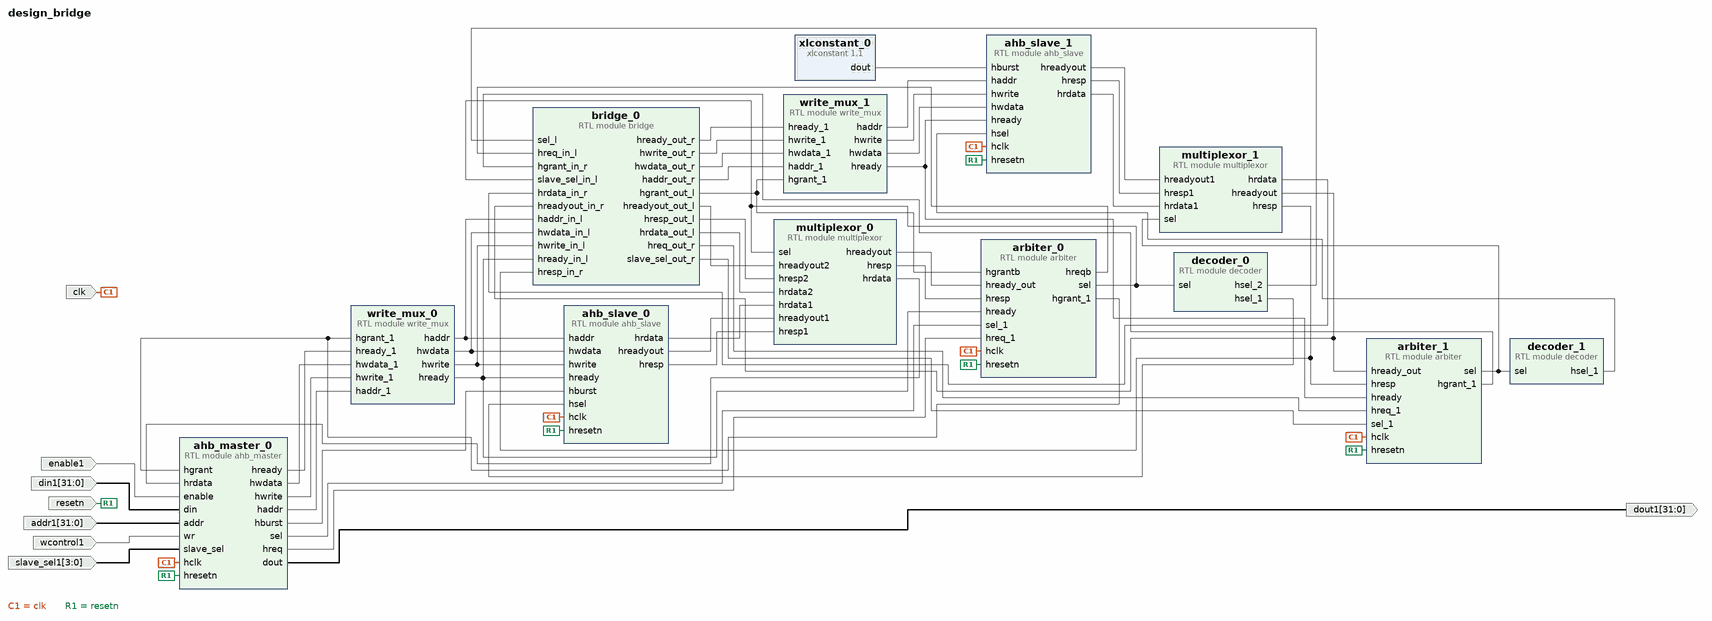
[diagram p0: block diagram of the top level]
# Vivado block design design_bridge, xc7z020clg484-1, Vivado 2019.1
create_bd_design design_bridge

create_bd_port -dir I enable1
create_bd_port -dir I -from 31 -to 0 -type data din1
create_bd_port -dir I -from 31 -to 0 addr1
create_bd_port -dir I wcontrol1
create_bd_port -dir I -from 3 -to 0 slave_sel1
create_bd_port -dir O -from 31 -to 0 -type data dout1
create_bd_port -dir I -type clk clk
set_property -dict {CONFIG.FREQ_HZ 20000000} [get_bd_ports clk]
create_bd_port -dir I -type rst resetn

create_bd_cell -type module -reference decoder decoder_0
create_bd_cell -type module -reference decoder decoder_1
create_bd_cell -type ip -vlnv xilinx.com:ip:xlconstant:1.1 xlconstant_0
set_property -dict {CONFIG.CONST_VAL 0 CONFIG.CONST_WIDTH 3} [get_bd_cells xlconstant_0]
create_bd_cell -type module -reference write_mux write_mux_0
create_bd_cell -type module -reference write_mux write_mux_1
create_bd_cell -type module -reference bridge bridge_0
create_bd_cell -type module -reference arbiter arbiter_0
create_bd_cell -type module -reference arbiter arbiter_1
create_bd_cell -type module -reference multiplexor multiplexor_0
create_bd_cell -type module -reference ahb_slave ahb_slave_0
create_bd_cell -type module -reference ahb_slave ahb_slave_1
create_bd_cell -type module -reference multiplexor multiplexor_1
create_bd_cell -type module -reference ahb_master ahb_master_0

# ---- connections ----

connect_bd_net [get_bd_pins ahb_master_0/sel] [get_bd_pins arbiter_0/sel_1]
connect_bd_net [get_bd_pins arbiter_0/sel] [get_bd_pins decoder_0/sel] [get_bd_pins bridge_0/slave_sel_in_l] [get_bd_pins multiplexor_0/sel]
connect_bd_net [get_bd_pins arbiter_0/hgrant_1] [get_bd_pins write_mux_0/hgrant_1] [get_bd_pins ahb_master_0/hgrant]
connect_bd_net [get_bd_ports clk] \
  [get_bd_pins arbiter_0/hclk] [get_bd_pins arbiter_1/hclk] [get_bd_pins ahb_slave_0/hclk] [get_bd_pins ahb_slave_1/hclk] \
  [get_bd_pins ahb_master_0/hclk]
connect_bd_net [get_bd_ports resetn] \
  [get_bd_pins arbiter_0/hresetn] [get_bd_pins arbiter_1/hresetn] [get_bd_pins ahb_slave_0/hresetn] \
  [get_bd_pins ahb_slave_1/hresetn] [get_bd_pins ahb_master_0/hresetn]
connect_bd_net [get_bd_pins decoder_0/hsel_2] [get_bd_pins bridge_0/sel_l]
connect_bd_net [get_bd_pins decoder_0/hsel_1] [get_bd_pins ahb_slave_0/hsel]
connect_bd_net [get_bd_pins arbiter_0/hreqb] [get_bd_pins bridge_0/hreq_in_l]
connect_bd_net [get_bd_pins ahb_slave_0/hrdata] [get_bd_pins multiplexor_0/hrdata1]
connect_bd_net [get_bd_pins ahb_slave_0/hreadyout] [get_bd_pins multiplexor_0/hreadyout1]
connect_bd_net [get_bd_pins ahb_slave_0/hresp] [get_bd_pins multiplexor_0/hresp1]
connect_bd_net [get_bd_pins multiplexor_0/hrdata] [get_bd_pins ahb_master_0/hrdata]
connect_bd_net [get_bd_pins multiplexor_0/hreadyout] [get_bd_pins arbiter_0/hready_out]
connect_bd_net [get_bd_pins multiplexor_0/hresp] [get_bd_pins arbiter_0/hresp]
connect_bd_net [get_bd_pins ahb_master_0/hreq] [get_bd_pins arbiter_0/hreq_1]
connect_bd_net [get_bd_pins write_mux_0/haddr] [get_bd_pins bridge_0/haddr_in_l] [get_bd_pins ahb_slave_0/haddr]
connect_bd_net [get_bd_pins write_mux_0/hready] [get_bd_pins bridge_0/hready_in_l] [get_bd_pins arbiter_0/hready] [get_bd_pins ahb_slave_0/hready]
connect_bd_net [get_bd_pins ahb_master_0/hready] [get_bd_pins write_mux_0/hready_1]
connect_bd_net [get_bd_pins ahb_master_0/hwdata] [get_bd_pins write_mux_0/hwdata_1]
connect_bd_net [get_bd_pins ahb_master_0/hwrite] [get_bd_pins write_mux_0/hwrite_1]
connect_bd_net [get_bd_pins ahb_master_0/haddr] [get_bd_pins write_mux_0/haddr_1]
connect_bd_net [get_bd_pins write_mux_0/hwdata] [get_bd_pins bridge_0/hwdata_in_l] [get_bd_pins ahb_slave_0/hwdata]
connect_bd_net [get_bd_pins write_mux_0/hwrite] [get_bd_pins bridge_0/hwrite_in_l] [get_bd_pins ahb_slave_0/hwrite]
connect_bd_net [get_bd_pins ahb_master_0/hburst] [get_bd_pins ahb_slave_0/hburst]
connect_bd_net -net enable1_1 [get_bd_ports enable1] [get_bd_pins ahb_master_0/enable]
connect_bd_net -net din1_1 [get_bd_ports din1] [get_bd_pins ahb_master_0/din]
connect_bd_net -net addr1_1 [get_bd_ports addr1] [get_bd_pins ahb_master_0/addr]
connect_bd_net -net wcontrol1_1 [get_bd_ports wcontrol1] [get_bd_pins ahb_master_0/wr]
connect_bd_net -net slave_sel1_1 [get_bd_ports slave_sel1] [get_bd_pins ahb_master_0/slave_sel]
connect_bd_net [get_bd_pins ahb_master_0/dout] [get_bd_ports dout1]
connect_bd_net [get_bd_pins bridge_0/hreq_out_r] [get_bd_pins arbiter_1/hreq_1]
connect_bd_net [get_bd_pins bridge_0/slave_sel_out_r] [get_bd_pins arbiter_1/sel_1]
connect_bd_net [get_bd_pins bridge_0/hgrant_out_l] [get_bd_pins write_mux_1/hgrant_1] [get_bd_pins arbiter_0/hgrantb]
connect_bd_net [get_bd_pins arbiter_1/hgrant_1] [get_bd_pins bridge_0/hgrant_in_r]
connect_bd_net [get_bd_pins arbiter_1/sel] [get_bd_pins decoder_1/sel] [get_bd_pins multiplexor_1/sel]
connect_bd_net [get_bd_pins decoder_1/hsel_1] [get_bd_pins ahb_slave_1/hsel]
connect_bd_net [get_bd_pins write_mux_1/haddr] [get_bd_pins ahb_slave_1/haddr]
connect_bd_net [get_bd_pins write_mux_1/hwrite] [get_bd_pins ahb_slave_1/hwrite]
connect_bd_net [get_bd_pins write_mux_1/hready] [get_bd_pins arbiter_1/hready] [get_bd_pins ahb_slave_1/hready]
connect_bd_net [get_bd_pins ahb_slave_1/hreadyout] [get_bd_pins multiplexor_1/hreadyout1]
connect_bd_net [get_bd_pins ahb_slave_1/hresp] [get_bd_pins multiplexor_1/hresp1]
connect_bd_net [get_bd_pins multiplexor_1/hrdata] [get_bd_pins bridge_0/hrdata_in_r]
connect_bd_net [get_bd_pins multiplexor_1/hreadyout] [get_bd_pins bridge_0/hreadyout_in_r] [get_bd_pins arbiter_1/hready_out]
connect_bd_net [get_bd_pins bridge_0/hreadyout_out_l] [get_bd_pins multiplexor_0/hreadyout2]
connect_bd_net [get_bd_pins bridge_0/hresp_out_l] [get_bd_pins multiplexor_0/hresp2]
connect_bd_net [get_bd_pins bridge_0/hrdata_out_l] [get_bd_pins multiplexor_0/hrdata2]
connect_bd_net [get_bd_pins multiplexor_1/hresp] [get_bd_pins bridge_0/hresp_in_r] [get_bd_pins arbiter_1/hresp]
connect_bd_net [get_bd_pins bridge_0/hready_out_r] [get_bd_pins write_mux_1/hready_1]
connect_bd_net [get_bd_pins bridge_0/hwrite_out_r] [get_bd_pins write_mux_1/hwrite_1]
connect_bd_net [get_bd_pins bridge_0/hwdata_out_r] [get_bd_pins write_mux_1/hwdata_1]
connect_bd_net [get_bd_pins bridge_0/haddr_out_r] [get_bd_pins write_mux_1/haddr_1]
connect_bd_net [get_bd_pins write_mux_1/hwdata] [get_bd_pins ahb_slave_1/hwdata]
connect_bd_net [get_bd_pins ahb_slave_1/hrdata] [get_bd_pins multiplexor_1/hrdata1]
connect_bd_net [get_bd_pins xlconstant_0/dout] [get_bd_pins ahb_slave_1/hburst]

validate_bd_design
save_bd_design
